# Altium schematic sheet BUS.schdoc: TITRE
size Letter; ApprovedBy: APPROUVÉ PAR; Organization: Cegep Limoilou; Address1: 1300, 8e Avenue; Address2: Québec, QC; Address3: Canada; Address4: G1J 5L5; SheetNumber: 4; SheetTotal: 4
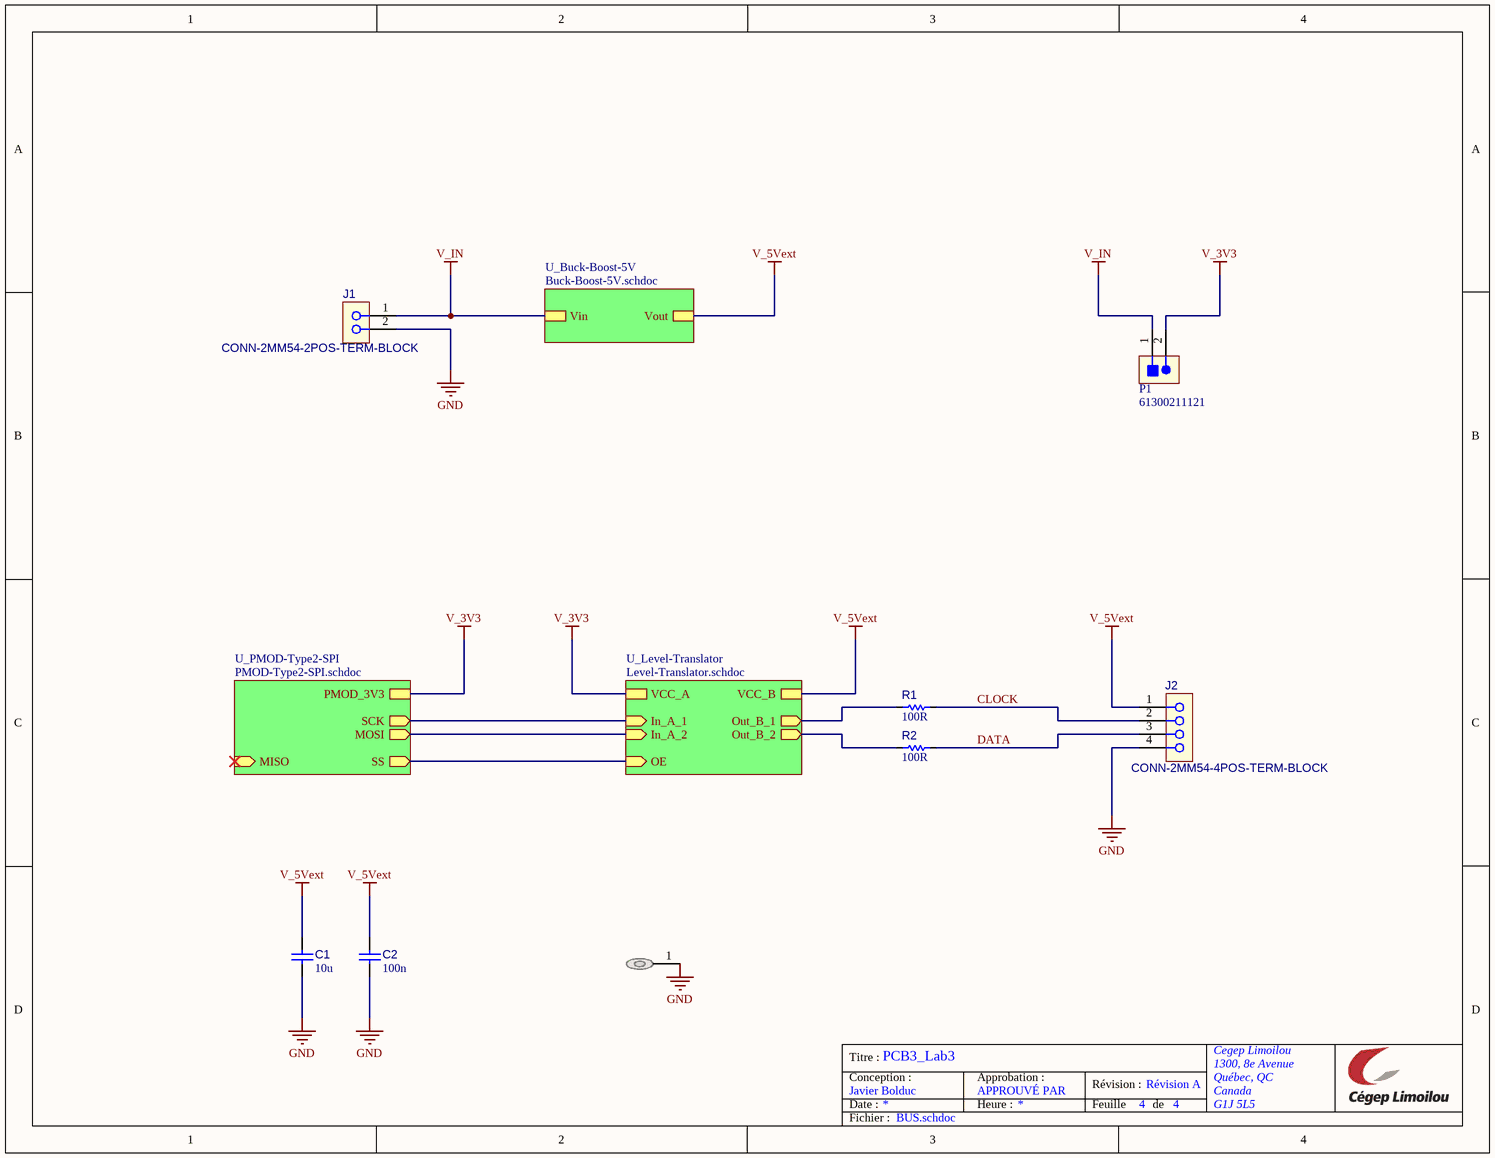
[diagram p0: BUS.schdoc]

## Parts
C1  value 10u  [C_2012[0805]]  (hidden comment: CAP CER 10uF 10V X?? 0805)
C2  value 100n  [C_2012[0805]]  (hidden comment: CAP CER 100nF 50V 0805)
J1  CONN-2MM54-2POS-TERM-BLOCK  [CONN_TERM_BLOCK_2POS_100MIL]
J2  CONN-2MM54-4POS-TERM-BLOCK  [CONN_TERM_BLOCK_4POS_100MIL]
MH?  DNP  [MP_M-Hole_#4-40_LOOSE-FIT]  (value not drawn)  (no BOM)
P1  61300211121  [CONN_HDR_2POS_100MILS_TH]
R1  value 100R  [R_1608[0603]]  (hidden comment: Res 100R 1% 0603)
R2  value 100R  [R_1608[0603]]  (hidden comment: Res 100R 1% 0603)

## Sub-sheets
U_Buck-Boost-5V = Buck-Boost-5V.schdoc: Vout, Vin
U_Level-Translator = Level-Translator.schdoc: VCC_A, In_A_1 (in), In_A_2 (in), OE (in), Out_B_2 (out), Out_B_1 (out), VCC_B
U_PMOD-Type2-SPI = PMOD-Type2-SPI.schdoc: SS (out), MOSI (out), SCK (out), PMOD_3V3, MISO (in)

## Nets
GND: C1.2 C2.2 J1.2 J2.4 MH?.1
V_3V3: P1.2 ; sheet U_Level-Translator/VCC_A, sheet U_PMOD-Type2-SPI/PMOD_3V3
V_5Vext: C1.1 C2.1 J2.1 ; sheet U_Buck-Boost-5V/Vout, sheet U_Level-Translator/VCC_B
V_IN: J1.1 P1.1 ; sheet U_Buck-Boost-5V/Vin
CLOCK: J2.2 R1.2
DATA: J2.3 R2.2
NetR1_1: R1.1 ; sheet U_Level-Translator/Out_B_1
NetR2_1: R2.1 ; sheet U_Level-Translator/Out_B_2
(unnamed): sheet U_Level-Translator/In_A_1, sheet U_PMOD-Type2-SPI/SCK
(unnamed): sheet U_Level-Translator/In_A_2, sheet U_PMOD-Type2-SPI/MOSI
(unnamed): sheet U_Level-Translator/OE, sheet U_PMOD-Type2-SPI/SS

## Notes on the sheet
- Titre :
- Conception :
- Date :
- Javier Bolduc
- PCB3_Lab3
- Approbation :
- Heure :
- Révision :
- Feuille
- Révision A
- de
- Fichier :

## Library data of the parts
C1 = CAP026: Capacitor type 1; LibRef: CAP026; Code CEGEP: KCOND94SM; Localisation: R13-C015-3; Rated Voltage: 10V; Mounting Technology: SMT
C2 = CAP008: Capacitor type 1; Manufacturer 1: Yageo; Manufacturer Part Number 1: CC0805KRX7R9BB104; LibRef: CAP008; Code CEGEP: KCOND0142SM; Tolerance: 10%; Dielectric: X7R; Rated Voltage: 50V; Mounting Technology: SMT; Supplier 1: LCSC; Supplier Part Number 1: C49678
J1 = CONN-2MM54-2POS-TERM-BLOCK: CONN TERM BLOCK 2POS 100mil pitch; Manufacturer 1: Dorabo; Manufacturer Part Number 1: DB125-2.54-2P-GN-S; Supplier 1: LCSC; Supplier Part Number 1: C918120; Mounting Technology: TH; Manufacturer 2: Amphenol; Manufacturer Part Number 2: VN02A1500000G; Supplier 2: Digikey; Supplier Part Number 2: VN02A1500000G-ND
J2 = CONN-2MM54-4POS-TERM-BLOCK: CONN TERM BLOCK 4POS 100mil pitch; Manufacturer 1: Dorabo; Manufacturer Part Number 1: DB125-2.54-4P-GN-S; Supplier 1: LCSC; Supplier Part Number 1: C918122; Mounting Technology: TH; Manufacturer 2: Amphenol; Manufacturer Part Number 2: VN04A1500000G; Supplier 2: Digikey; Supplier Part Number 2: VN04A1500000G-ND
MH? = MH-4-40: Mounting Hole #4-40 w/ Flat Washer; Manufacturer Part Number 1: DNP; Value: DNP; Supplier Part Number 1: N/A
P1 = CONN-100MIL-HDR-01X02: CONN HEADER 2POS 100MIL; Manufacturer 1: Megastar; Manufacturer Part Number 1: ZX-PZ2.54-1-2PZZ; Mounting Technology: TH; Supplier 1: LCSC; Supplier Part Number 1: C7501260; Manufacturer 2: Würth Elektronik; Manufacturer Part Number 2: 61300211121
R1 R2 = RES029: Resistor type 1; Manufacturer 1: Yageo; Manufacturer Part Number 1: RC0603FR-07100RL; LibRef: RES029; Puissance: 1/10W; Max Working Voltage: 75V; Tolerance: 1%; Mounting Technology: SMT; Supplier 1: LCSC; Supplier Part Number 1: C105588